# Altium project My_WS2812.PrjPcb
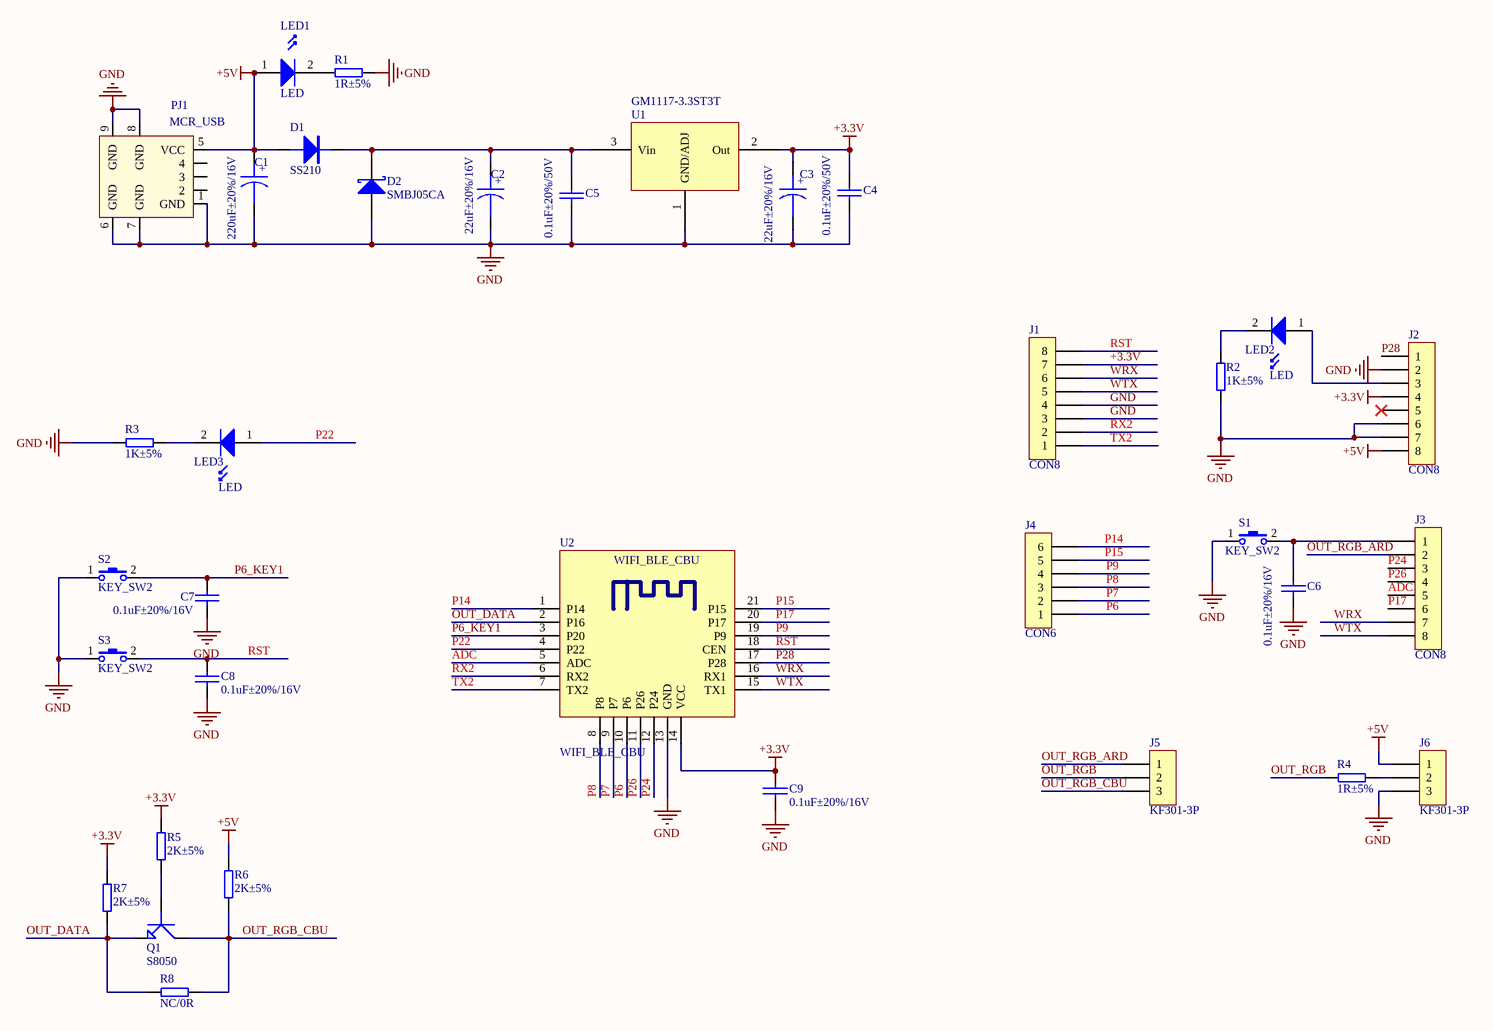
[diagram p0: my_ws2812.SchDoc]
1 sheet, 35 parts. Net scope: global (net labels, ports and power ports of the same name join across sheets).
Board file: my_ws2812.PcbDoc

## Sheet my_ws2812.SchDoc
size 381 x 241 mm; SheetNumber: 1; SheetTotal: 1

### Parts
C1  220uF±20%/16V  [CD0.15]
C2  22uF±20%/16V  [钽电容B3528]
C3  22uF±20%/16V  [钽电容B3528]
C4  0.1uF±20%/50V  [C0603]
C5  0.1uF±20%/50V  [C0603]
C6  0.1uF±20%/16V  [C0603]
C7  0.1uF±20%/16V  [C0603]
C8  0.1uF±20%/16V  [C0603]
C9  0.1uF±20%/16V  [C0603]
D1  SS210  [SMA(DO-214AC)]
D2  SMBJ05CA  [SMB(DO-214AA)]
J1  CON8  [HDR1X8Z]
J2  CON8  [HDR1X8Z]
J3  CON8  [HDR1X8Z]
J4  CON6  [HDR1X6Z]
J5  KF301-3P  [SIP3 - 2.54]
J6  KF301-3P  [SIP3 - 2.54]
LED1  LED  [LED0805_1]
LED2  LED  [LED0805_1]
LED3  LED  [LED0805_1]
PJ1  MCR_USB  [MICRO_USB-NEW-16.12.12]
Q1  S8050  [SOT-23-NPN]
R1  1R±5%  [R0603]
R2  1K±5%  [R0603]
R3  1K±5%  [R0603]
R4  1R±5%  [R0603]
R5  2K±5%  [R0603]
R6  2K±5%  [R0603]
R7  2K±5%  [R0603]
R8  NC/0R  [R0603]
S1  KEY_SW2  [KEY4-SMD]
S2  KEY_SW2  [KEY4-SMD]
S3  KEY_SW2  [KEY4-SMD]
U1  GM1117-3.3ST3T  [SOT-223]
U2  WIFI_BLE_CBU  [WIFI_BLE_CBU]

### Nets
+3.3V: C3.1 C4.1 C9.2 J1.7 J2.4 R5.1 R7.1 U1.2(Out) U2.14(VCC)
+5V: C1.1 D1.1 J2.8 J6.1 LED1.1 PJ1.5(VCC) R6.1
GND: C1.2 C2.2 C3.2 C4.2 C5.2 C6.1 C7.1 C8.2 C9.1 D2.1(A) J1.3 J1.4 J2.2 J2.6 J2.7 J6.3 PJ1.1(GND) PJ1.6(GND) PJ1.7(GND) PJ1.8(GND) PJ1.9(GND) R1.2 R2.1 R3.2 S1.1 S2.1 S3.1 U1.1(GND/ADJ) U2.13(GND)
ADC: J3.5 U2.5(ADC)
OUT_DATA: Q1.1(E) R7.2 R8.1 U2.2(P16)
OUT_RGB: J5.2 R4.1
OUT_RGB_ARD: J3.2 J5.1
OUT_RGB_CBU: J5.3 Q1.3(C) R6.2 R8.2
P6: J4.1 U2.10(P6)
P6_KEY1: C7.2 S2.2 U2.3(P20)
P7: J4.2 U2.9(P7)
P8: J4.3 U2.8(P8)
P9: J4.4 U2.19(P9)
P14: J4.6 U2.1(P14)
P15: J4.5 U2.21(P15)
P17: J3.6 U2.20(P17)
P22: LED3.1 U2.4(P22)
P24: J3.3 U2.12(P24)
P26: J3.4 U2.11(P26)
P28: J2.1 U2.17(P28)
RST: C8.1 J1.8 S3.2 U2.18(CEN)
RX2: J1.2 U2.6(RX2)
TX2: J1.1 U2.7(TX2)
WRX: J1.6 J3.7 U2.16(RX1)
WTX: J1.5 J3.8 U2.15(TX1)
NetC2_1: C2.1 C5.1 D1.2 D2.2(K) U1.3(Vin)
NetC6_2: C6.2 J3.1 S1.2
NetJ2_3: J2.3 LED2.1
NetJ6_2: J6.2 R4.2
NetLED1_2: LED1.2 R1.1
NetLED2_2: LED2.2 R2.2
NetLED3_2: LED3.2 R3.1
NetQ1_2: Q1.2(B) R5.2

Not connected (* = marked no-connect by the designer): J2 5*; PJ1 2 3 4

### Notes on the sheet
- (in symbol CAPACITOR POL) +

### Library data of the parts
C1-C3 = CAPACITOR POL: Capacitor
C4-C9 = CAP: Capacitor
D1 = Diode1: Diode
D2 = D Schottky: Schottky Diode; MFR: Toshiba
J1-J3 = CON8: Connector
J4 = CON6: Connector
J5 J6 = CON3: Connector
Q1 = NPN: NPN Transistor
R1-R8 = RES5
U1 = GM1117
U2 = WIFI_BLE_CBU: Module
LED1-LED3 = LED: Published: *; LatestRevisionDate: *; LatestRevisionNote: *; DatasheetDocument: *; PackageDocument: *; PackageReference: *; Publisher: *; ComponentLink1Description: *; ComponentLink1URL: *; Code_JEDEC: *
PJ1 = MCR_USB: Published: *; Revision 1: *; Revision 2: *; Datasheet: *; Publisher: *